# Altium schematic sheet GPRS通信.SchDoc
size A3
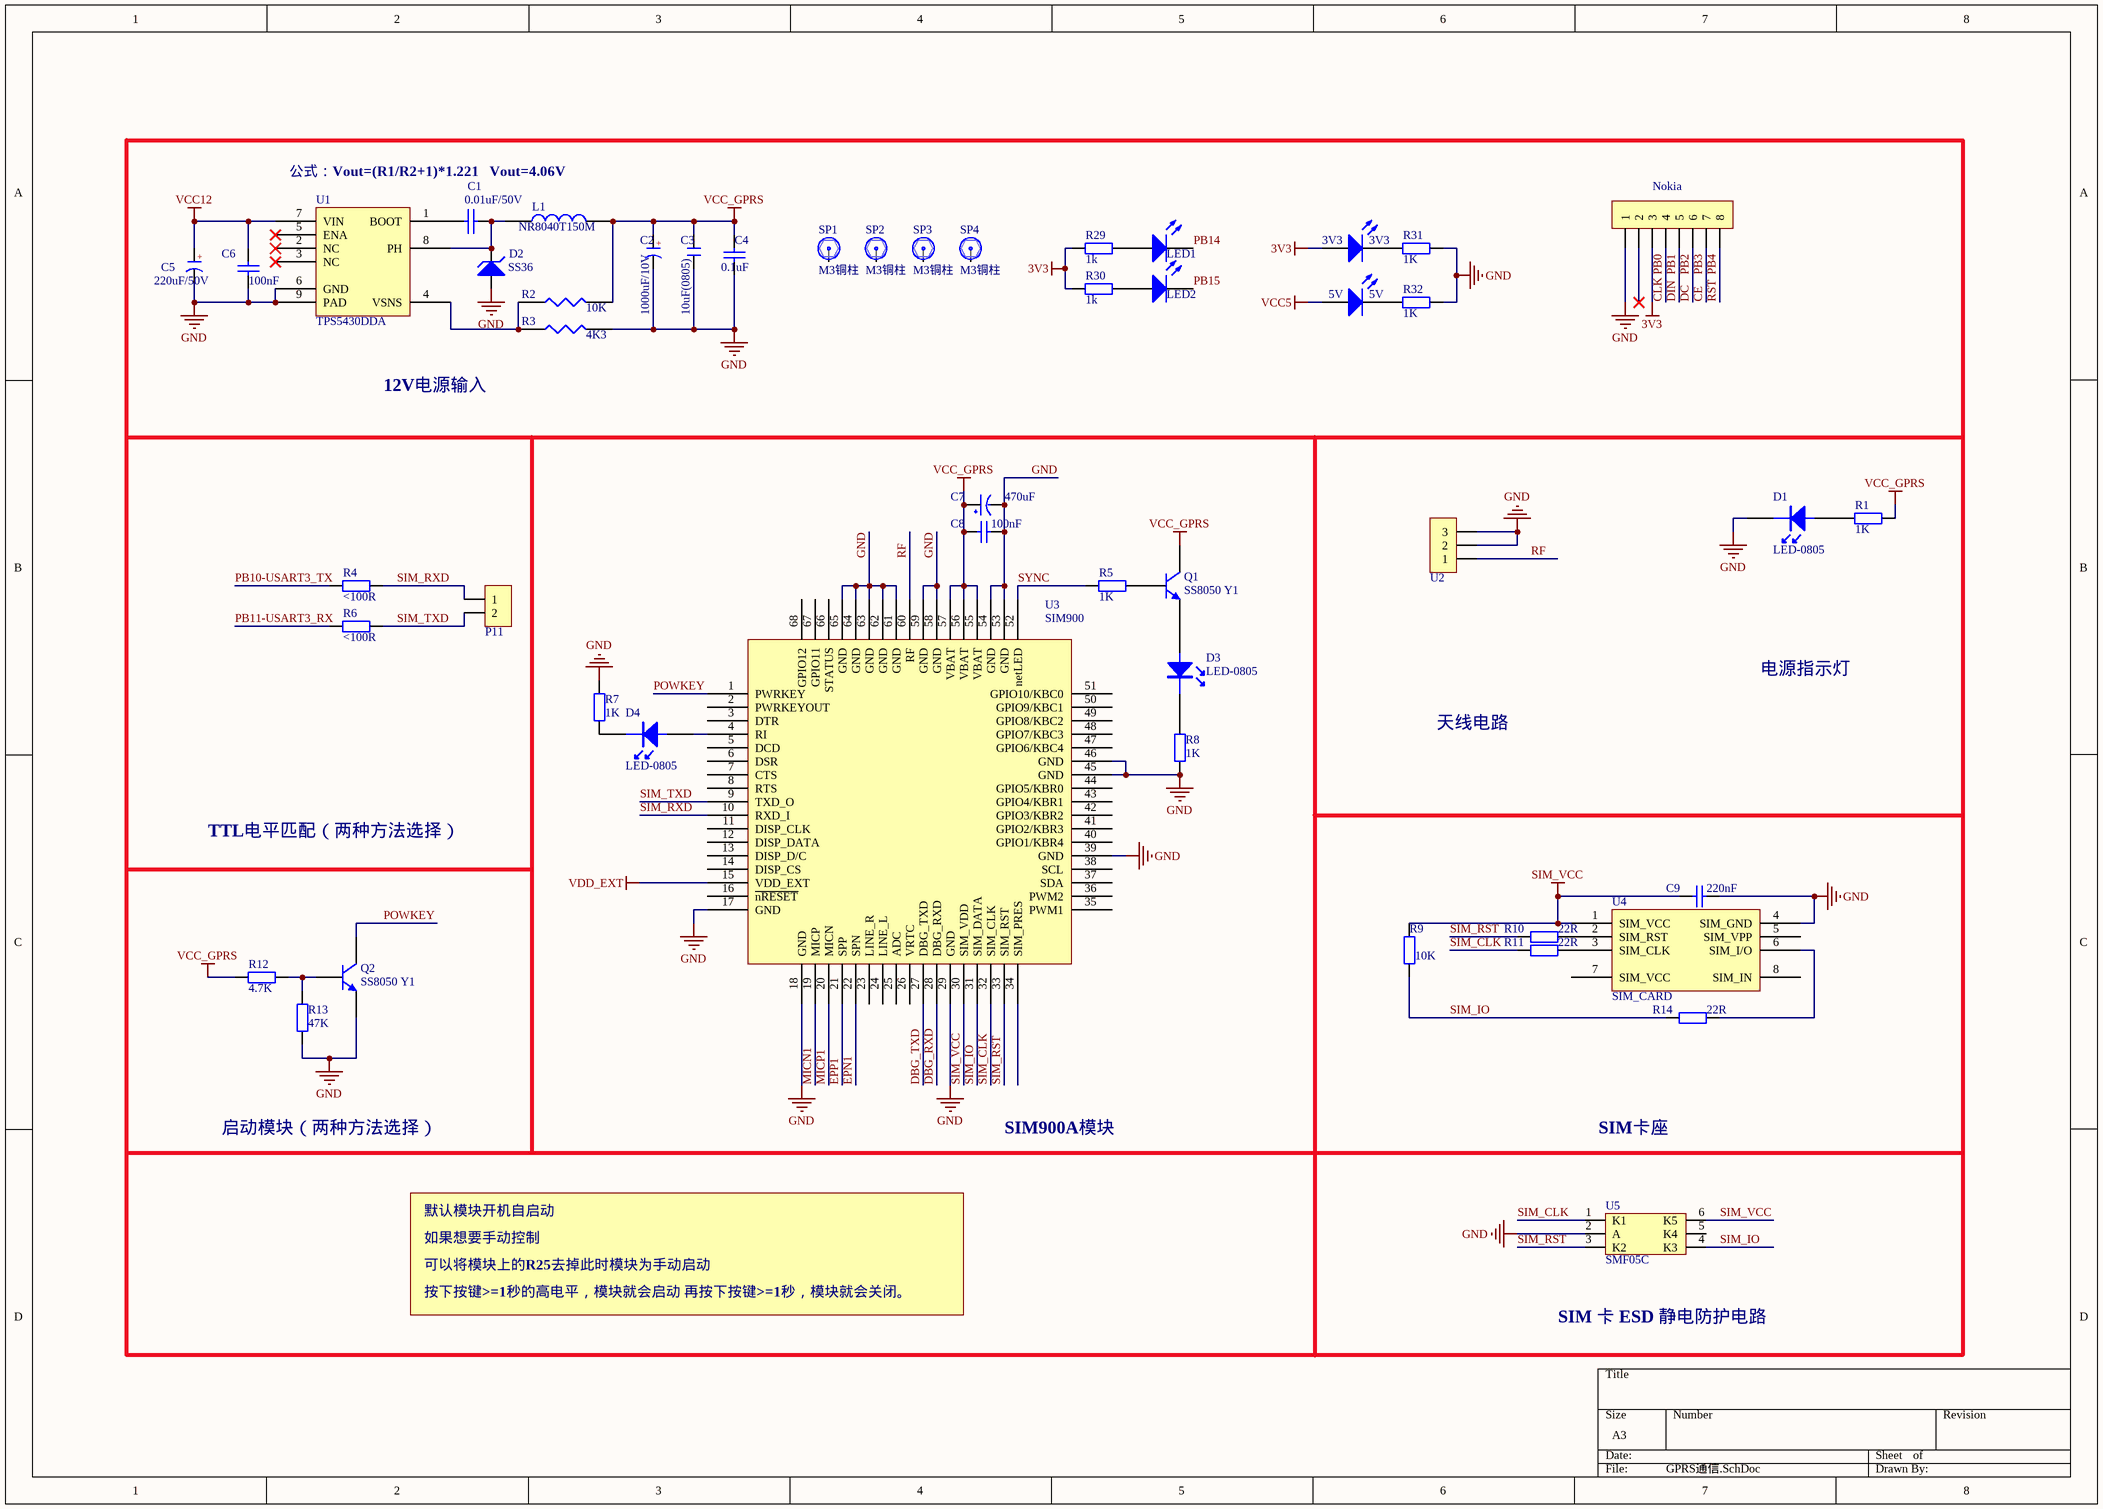
[diagram p0: GPRS通信.SchDoc]

## Parts
3V3  3V3  [LED 0805G]
5V  5V  [LED 0805G]
C1  0.01uF/50V  [LC-0603_C]
C2  1000uF/10V  [CAP 5.0*10*20 - BK]
C3  10uF(0805)  [C 0805_L]
C4  0.1uF  [LC-0603_C]
C5  220uF/50V  [CAP 3.5*8*11.5 - BK]
C6  100nF  [LC-0603_C]
C7  470uF  [CM E(8*10.2)]
C8  100nF  [LC-0603_C]
C9  220nF  [LC-0603_C]
D1  LED-0805  [LED 0805G]
D2  SS36  [D1812]
D3  LED-0805  [LED 0805G]
D4  LED-0805  [LED 0805G]
L1  NR8040T150M  [NR8040]
LED1  (no value)  [LED 0805G]
LED2  (no value)  [LED 0805G]
Nokia  HDR-1X8  [HDR2.54-M-LI-8P]  (value not drawn)
P11  HDR-1X2  [HDR2.54-LI-2P]  (value not drawn)
Q1  SS8050 Y1  [LC-SOT-23(SOT-23-3)]
Q2  SS8050 Y1  [LC-SOT-23(SOT-23-3)]
R1  1K  [LC-0603_R]
R2  10K  [LC-0603_R]
R3  4K3  [LC-0603_R]
R4  <100R  [LC-0603_R]
R5  1K  [LC-0603_R]
R6  <100R  [LC-0603_R]
R7  1K  [LC-0603_R]
R8  1K  [LC-0603_R]
R9  10K  [LC-0603_R]
R10  22R  [LC-0603_R]
R11  22R  [LC-0603_R]
R12  4.7K  [LC-0603_R]
R13  47K  [LC-0603_R]
R14  22R  [LC-0603_R]
R29  1k  [LC-0603_R]
R30  1k  [LC-0603_R]
R31  1K  [LC-0603_R]
R32  1K  [LC-0603_R]
SP1  M3铜柱  [M3x10+6_N]
SP2  M3铜柱  [M3x10+6_N]
SP3  M3铜柱  [M3x10+6_N]
SP4  M3铜柱  [M3x10+6_N]
U1  TPS5430DDA  [SO-G8]
U2  HDR-1X3  [SMA-KE-LI]  (value not drawn)
U3  SIM900  [GSM_900A]
U4  SIM_CARD  [MICRO SIM6]
U5  SMF05C  [SOT-363]

## Nets
3V3: 3V3.1(A) Nokia.3 R29.1 R30.1
GND: C2.2(K) C3.1 C4.1 C5.2(K) C6.2 C7.2(GND) C8.2 C9.2 D1.1(-) D2.1(A) Nokia.1 Q2.2(E) R3.2 R7.2 R8.2 R13.1 R31.1 R32.1 U1.6(GND) U1.9(PAD) U2.2 U2.3 U3.17(GND) U3.18(GND) U3.29(GND) U3.39(GND) U3.45(GND) U3.46(GND) U3.53(GND) U3.54(GND) U3.58(GND) U3.59(GND) U3.61(GND) U3.62(GND) U3.63(GND) U3.64(GND) U3.65(GND) U4.4(SIM_GND) U5.2(A)
SIM_VCC: C9.1 R9.2 U3.30(SIM_VDD) U4.1(SIM_VCC) U5.6(K5)
VCC5: 5V.1(A)
VCC12: C5.1(A) C6.1 U1.7(VIN)
VCC_GPRS: C2.1(A) C3.2 C4.2 C7.1(VCC) C8.1 L1.2 Q1.3(C) R1.1 R2.2 R12.1 U3.55(VBAT) U3.56(VBAT) U3.57(VBAT)
VDD_EXT: U3.15(VDD_EXT)
CE: Nokia.7  [also labelled PB3]
CLK: Nokia.4  [also labelled PB0]
DBG_RXD: U3.28(DBG_RXD)
DBG_TXD: U3.27(DBG_TXD)
DC: Nokia.6  [also labelled PB2]
DIN: Nokia.5  [also labelled PB1]
EPN1: U3.22(SPN)
EPP1: U3.21(SPP)
MICN1: U3.19(MICP)
MICP1: U3.20(MICN)
PB4: Nokia.8  [also labelled RST]
PB10-USART3_TX: R4.1
PB11-USART3_RX: R6.1
PB14: LED1.2(K)
PB15: LED2.2(K)
POWKEY: Q2.3(C) U3.1(PWRKEY)
RF: U2.1 U3.60(RF)
SIM_CLK: R11.2 U3.32(SIM_CLK) U5.1(K1)
SIM_IO: R9.1 R14.2 U3.31(SIM_DATA) U5.4(K3)
SIM_RST: R10.2 U3.33(SIM_RST) U5.3(K2)
SIM_RXD: P11.1 R4.2 U3.10(RXD_I)
SIM_TXD: P11.2 R6.2 U3.9(TXD_O)
SYNC: R5.2 U3.52(netLED)
Net3V3_2: 3V3.2(K) R31.2
Net5V_2: 5V.2(K) R32.2
NetC1_1: C1.1 U1.1(BOOT)
NetC1_2: C1.2 D2.2(K) L1.1 U1.8(PH)
NetD1_2: D1.2(+) R1.2
NetD3_1: D3.1(-) R8.1
NetD3_2: D3.2(+) Q1.2(E)
NetD4_1: D4.1(-) R7.1
NetD4_2: D4.2(+) U3.4(RI)
NetLED1_1: LED1.1(A) R29.2
NetLED2_1: LED2.1(A) R30.2
NetQ1_1: Q1.1(B) R5.1
NetQ2_1: Q2.1(B) R12.2 R13.2
NetR2_1: R2.1 R3.1 U1.4(VSNS)
NetR10_1: R10.1 U4.2(SIM_RST)
NetR11_1: R11.1 U4.3(SIM_CLK)
NetR14_1: R14.1 U4.6(SIM_I/O)

Not connected (* = marked no-connect by the designer): Nokia 2*; SP1 1; SP2 1; SP3 1; SP4 1; U1 2(NC)* 3(NC)* 5(ENA)*; U3 2(PWRKEYOUT) 3(DTR) 5(DCD) 6(DSR) 7(CTS) 8(RTS) 11(DISP_CLK) 12(DISP_DATA) 13(DISP_D/C) 14(DISP_CS) 16(~{nRESET}) 23(LINE_R) 24(LINE_L) 25(ADC) 26(VRTC) 34(SIM_PRES) 35(PWM1) 36(PWM2) 37(SDA) 38(SCL) 40(GPIO1/KBR4) 41(GPIO2/KBR3) 42(GPIO3/KBR2) 43(GPIO4/KBR1) 44(GPIO5/KBR0) 47(GPIO6/KBC4) 48(GPIO7/KBC3) 49(GPIO8/KBC2) 50(GPIO9/KBC1) 51(GPIO10/KBC0) 66(STATUS) 67(GPIO11) 68(GPIO12); U4 5(SIM_VPP) 7(SIM_VCC) 8(SIM_IN); U5 5(K4)

## Notes on the sheet
- 公式：Vout=(R1/R2+1)*1.221   Vout=4.06V
- 12V电源输入
- 电源指示灯
- 天线电路
- TTL电平匹配（两种方法选择）
- 启动模块（两种方法选择）
- SIM900A模块
- SIM卡座
- 默认模块开机自启动
- 如果想要手动控制
- 可以将模块上的R25去掉此时模块为手动启动
- 按下按键>=1秒的高电平，模块就会启动 再按下按键>=1秒，模块就会关闭。
- SIM 卡 ESD 静电防护电路
- (in symbol C-CAP) +

## Library data of the parts
3V3 5V LED1 LED2 = LED0: Typical INFRARED GaAs LED; Published: 8-Jun-2000; LatestRevisionDate: 08-Jul-2005; LatestRevisionNote: Mech Layer 1 removed.; PackageReference: LED-0; Publisher: Altium Limited
C1 = CAP: Capacitor
C2 C5 = C-CAP: 直插电解电容; 版权归属: 源创客; BOM名称: 直插电解电容; 学习资源: www.ooocke.com
C3 = C: 无极性贴片电容; 版权归属: 源创客; BOM名称: 无极性贴片电容; 学习资源: www.ooocke.com
C4 = 0603 1.0pF (010) 0.25pF 50V: 贴片电容; ComponentLink1Description: 供应商链接; ComponentLink1URL: http://www.szlcsc.com/product/details_24709.html; Package: 0603; Supplier: LC; SuppliersPartNumber: C23969
C6 C8 C9 = 0603 1uF (105) 10% 50V: 贴片电容; ComponentLink1Description: 供应商链接; ComponentLink1URL: http://www.szlcsc.com/product/details_16531.html; Package: 0603; Supplier: LC; SuppliersPartNumber: C15849
C7 = CAP
D1 D3 D4 = LED_SMD: 贴片LED
D2 = SS36: Zener Diode
L1 = INDUCTOR
Nokia = Header 8: 8P接插件; 版权归属: 源创客; BOM名称: 8P接插件; 学习资源: www.ooocke.com
P11 = Header 2: 2P接插件; 版权归属: 源创客; BOM名称: 2P接插件; 学习资源: www.ooocke.com
Q1 Q2 = SOT-23 SS8050 Y1: 三极管; ComponentLink1Description: 供应商链接; ComponentLink1URL: http://www.szlcsc.com/product/details_2507.html; Package: SOT-23; Supplier: LC; SuppliersPartNumber: C2150
R1 R4-R14 = 0603 2KΩ (2001) 1%: 贴片电阻; ComponentLink1Description: 供应商链接; ComponentLink1URL: http://www.szlcsc.com/product/details_23702.html; Package: 0603; Supplier: LC; SuppliersPartNumber: C22975
R2 R3 = RES1
R29 R30 = Res1: 贴片电阻; Published: 8-Jun-2000; LatestRevisionDate: 17-Jul-2002; LatestRevisionNote: Re-released for DXP Platform.; PackageReference: AXIAL-0.4; Publisher: Altium Limited; Value: 1K
R31 R32 = 0603 1.1KΩ (1101) 1%: 贴片电阻; ComponentLink1Description: 供应商链接; ComponentLink1URL: http://www.szlcsc.com/product/details_23491.html; Package: 0603; Supplier: LC; SuppliersPartNumber: C22764
SP1-SP4 = 铜柱加头大焊盘: 铜柱; 版权归属: 源创客; BOM名称: 铜柱; 学习资源: www.ooocke.com
U2 = Header 3: 3P接插件; 版权归属: 源创客; BOM名称: 3P接插件; 学习资源: www.ooocke.com
U4 = SIM_CARD: SIM中卡卡槽
U5 = SMF05C: TVS